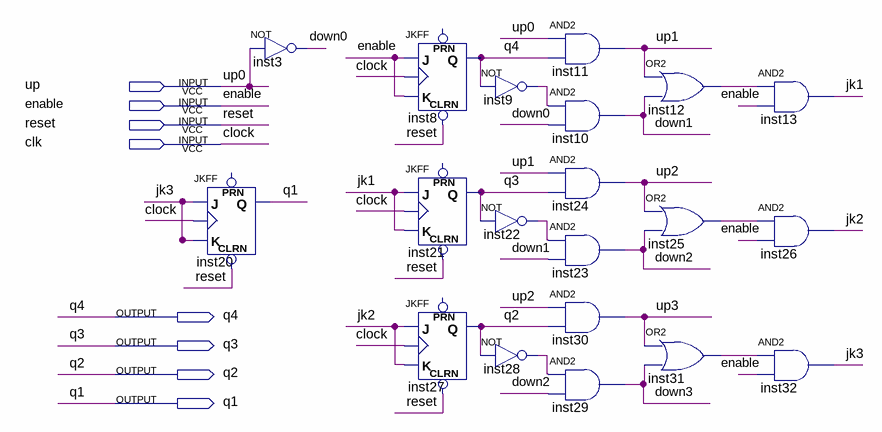
[diagram p0: schematic sheet]
// Quartus schematic counter.bdf as structural Verilog: 20 symbols, 8 pins
module counter (
  input  up,
  input  enable,
  input  reset,
  input  clk,
  output q4,
  output q3,
  output q2,
  output q1
);

  wire down0, down1, down2, down3, inst9_out, inst12_out, inst22_out, inst25_out, inst28_out, inst31_out,
       jk1, jk2, jk3, up1, up2, up3;

  JKFF inst20 (.CLRN(reset), .K(jk3), .J(jk3), .CLK(clk), .Q(q1));  // open: PRN
  not inst3 (down0, up);
  JKFF inst8 (.CLRN(reset), .K(enable), .J(enable), .CLK(clk), .Q(q4));  // open: PRN
  JKFF inst21 (.CLRN(reset), .K(jk1), .J(jk1), .CLK(clk), .Q(q3));  // open: PRN
  JKFF inst27 (.CLRN(reset), .K(jk2), .J(jk2), .CLK(clk), .Q(q2));  // open: PRN
  not inst9 (inst9_out, q4);
  not inst22 (inst22_out, q3);
  not inst28 (inst28_out, q2);
  and inst11 (up1, up, q4);
  and inst10 (down1, inst9_out, down0);
  and inst24 (up2, up1, q3);
  and inst23 (down2, inst22_out, down1);
  and inst30 (up3, up2, q2);
  and inst29 (down3, inst28_out, down2);
  or inst12 (inst12_out, up1, down1);
  or inst25 (inst25_out, up2, down2);
  or inst31 (inst31_out, up3, down3);
  and inst13 (jk1, inst12_out, enable);
  and inst26 (jk2, inst25_out, enable);
  and inst32 (jk3, inst31_out, enable);

  // Other names for the same wires on the sheet: clock = clk; up0 = up
endmodule
